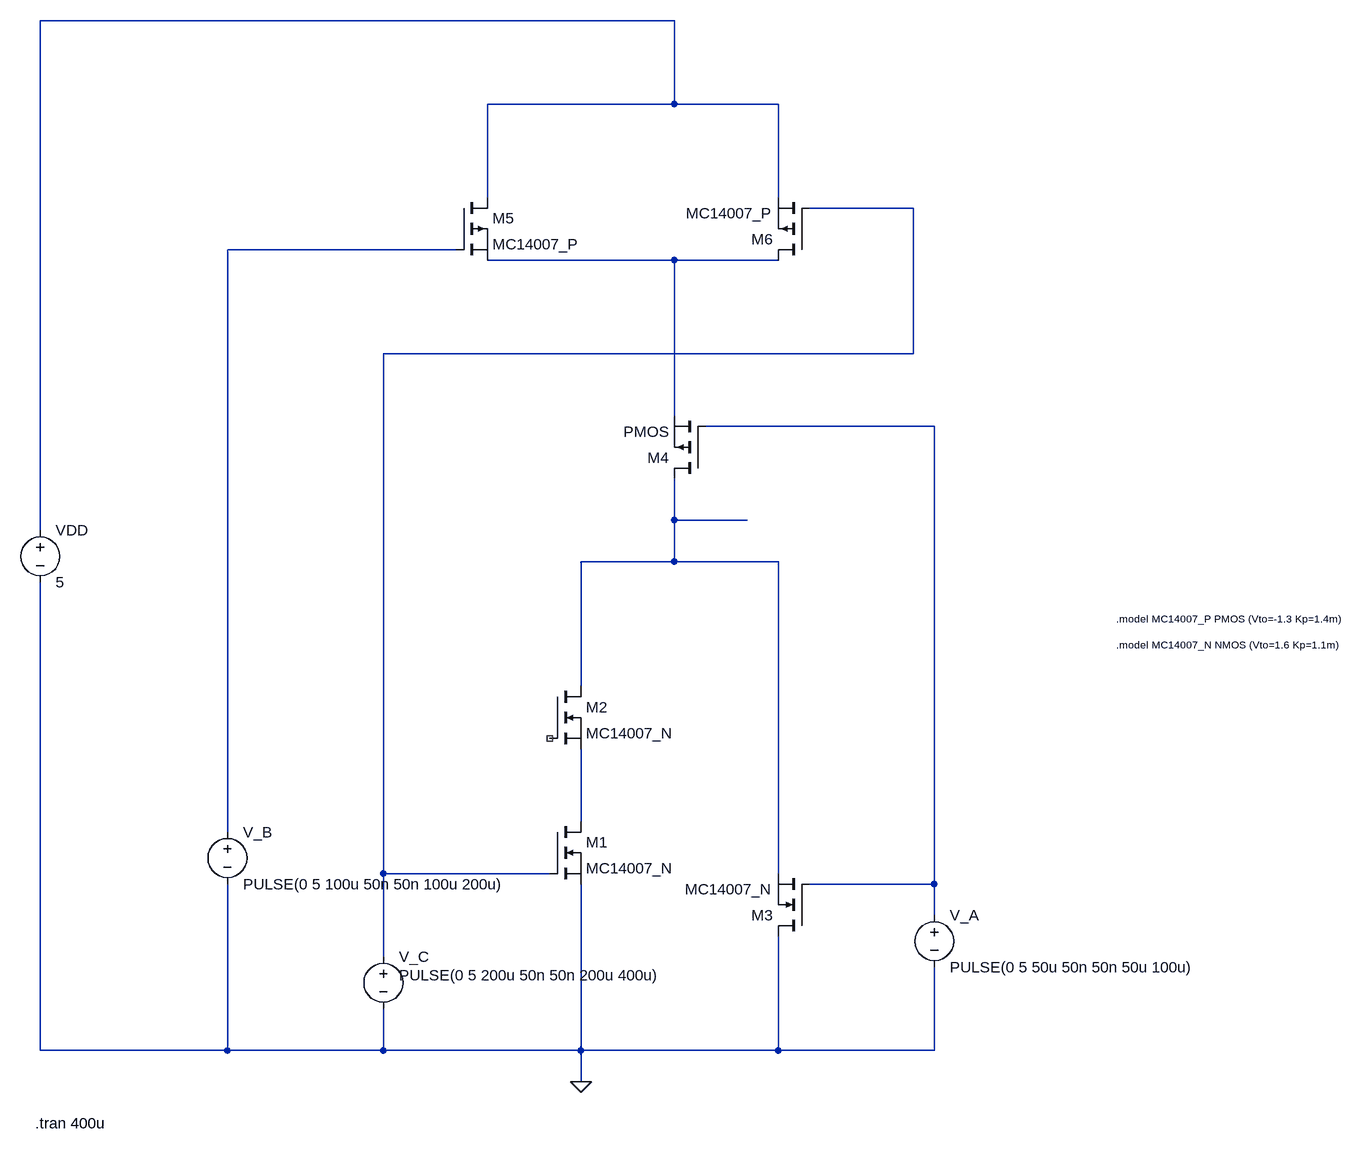
[diagram p0: schematic 1.4.1.asc]
1.4.1.asc, the LTspice schematic file:
Version 4
SHEET 1 1236 680
WIRE -288 -1264 -1264 -1264
WIRE -288 -1136 -288 -1264
WIRE -288 -1136 -576 -1136
WIRE -128 -1136 -288 -1136
WIRE -576 -992 -576 -1136
WIRE -128 -992 -128 -1136
WIRE 80 -976 -80 -976
WIRE -624 -912 -976 -912
WIRE -288 -896 -576 -896
WIRE -128 -896 -288 -896
WIRE 80 -752 80 -976
WIRE 80 -752 -736 -752
WIRE -288 -656 -288 -896
WIRE 112 -640 -240 -640
WIRE -288 -496 -288 -560
WIRE -176 -496 -288 -496
WIRE -1264 -480 -1264 -1264
WIRE -288 -432 -288 -496
WIRE -288 -432 -432 -432
WIRE -128 -432 -288 -432
WIRE -432 -240 -432 -432
WIRE -432 -32 -432 -144
WIRE -976 -16 -976 -912
WIRE -736 48 -736 -752
WIRE -480 48 -736 48
WIRE -128 48 -128 -432
WIRE 112 64 112 -640
WIRE 112 64 -80 64
WIRE 112 112 112 64
WIRE -736 176 -736 48
WIRE -1264 320 -1264 -400
WIRE -976 320 -976 64
WIRE -976 320 -1264 320
WIRE -736 320 -736 256
WIRE -736 320 -976 320
WIRE -432 320 -432 64
WIRE -432 320 -736 320
WIRE -128 320 -128 144
WIRE -128 320 -432 320
WIRE 112 320 112 192
WIRE 112 320 -128 320
WIRE -432 368 -432 320
FLAG -432 368 0
SYMBOL nmos -480 -32 R0
SYMATTR InstName M1
SYMATTR Value MC14007_N
SYMBOL voltage -736 160 R0
WINDOW 3 24 44 Left 2
WINDOW 123 0 0 Left 0
WINDOW 39 0 0 Left 0
SYMATTR Value PULSE(0 5 200u 50n 50n 200u 400u)
SYMATTR InstName V_C
SYMBOL nmos -480 -240 R0
SYMATTR InstName M2
SYMATTR Value MC14007_N
SYMBOL voltage -976 -32 R0
WINDOW 123 0 0 Left 0
WINDOW 39 0 0 Left 0
SYMATTR InstName V_B
SYMATTR Value PULSE(0 5 100u 50n 50n 100u 200u)
SYMBOL voltage 112 96 R0
WINDOW 123 0 0 Left 0
WINDOW 39 0 0 Left 0
SYMATTR InstName V_A
SYMATTR Value PULSE(0 5 50u 50n 50n 50u 100u)
SYMBOL voltage -1264 -496 R0
SYMATTR InstName VDD
SYMATTR Value 5
SYMBOL nmos -80 144 R180
SYMATTR InstName M3
SYMATTR Value MC14007_N
SYMBOL pmos -240 -560 R180
SYMATTR InstName M4
SYMBOL pmos -80 -896 R180
SYMATTR InstName M6
SYMATTR Value MC14007_P
SYMBOL pmos -624 -992 R0
SYMATTR InstName M5
SYMATTR Value MC14007_P
TEXT 392 -304 Left 1 !.model MC14007_N NMOS (Vto=1.6 Kp=1.1m)
TEXT 392 -344 Left 1 !.model MC14007_P PMOS (Vto=-1.3 Kp=1.4m)
TEXT -1272 432 Left 2 !.tran 400u

The netlist it stands for:
* 1.4.1.asc
M1 N007 N002 0 0 MC14007_N
V_C N002 0 PULSE(0 5 200u 50n 50n 200u 400u)
M2 N006 NC_01 N007 N007 MC14007_N
V_B N003 0 PULSE(0 5 100u 50n 50n 100u 200u)
V_A N005 0 PULSE(0 5 50u 50n 50n 50u 100u)
VDD N001 0 5
M3 0 N005 N006 N006 MC14007_N
M4 N006 N005 N004 N004 PMOS
M6 N004 N002 N001 N001 MC14007_P
M5 N001 N003 N004 N004 MC14007_P
.model NMOS NMOS
.model PMOS PMOS
.lib standard.mos
.model MC14007_N NMOS (Vto=1.6 Kp=1.1m)
.model MC14007_P PMOS (Vto=-1.3 Kp=1.4m)
.tran 400u
.backanno
.end